# Altium schematic sheet obc_spi_to_i2c.SchDoc: SPI to I2C Bridge
size A4; DrawnBy: Mohamed Hirole; Organization: UTAT SS; DocumentNumber: 4; Revision: 1.0; SheetNumber: 4; SheetTotal: 8
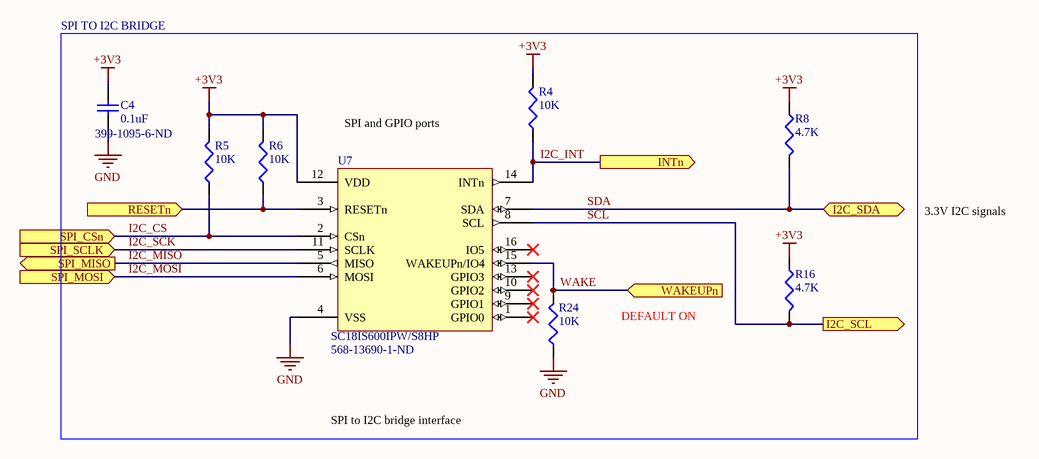
[diagram p0: obc_spi_to_i2c.SchDoc]

## Parts
C4  0.1uF  Supplier Part Number 1: 399-1095-6-ND  [1608[0603]]
R4  10K  [J1-0603]
R5  10K  [J1-0603]
R6  10K  [J1-0603]
R8  4.7K  [J1-0603]
R16  4.7K  [J1-0603]
R24  10K  [J1-0603]
U7  SC18IS600IPW/S8HP  Supplier Part Number 1: 568-13690-1-ND  [TSOP65P640X110-16N]

## Ports
I2C_SCL (out), I2C_SDA (bidir), INTn (out), RESETn (in), SPI_CSn (in), SPI_MISO (out), SPI_MOSI (in), SPI_SCLK (in), WAKEUPn (in)

## Nets
+3V3: C4.2 R4.2 R5.2 R6.2 R8.1 R16.1 U7.12(VDD)
GND: C4.1 R24.1 U7.4(VSS)
I2C_CS: R5.1 U7.2(CSn) ; port SPI_CSn
I2C_INT: R4.1 U7.14(INTn) ; port INTn
I2C_MISO: U7.5(MISO) ; port SPI_MISO
I2C_MOSI: U7.6(MOSI) ; port SPI_MOSI
I2C_SCK: U7.11(SCLK) ; port SPI_SCLK
RESETn: R6.1 U7.3(RESETn) ; port RESETn
SCL: R16.2 U7.8(SCL) ; port I2C_SCL
SDA: R8.2 U7.7(SDA) ; port I2C_SDA
WAKE: R24.2 U7.15(WAKEUPn/IO4) ; port WAKEUPn

Not connected (* = marked no-connect by the designer): U7 1(GPIO0)* 9(GPIO1)* 10(GPIO2)* 13(GPIO3)* 16(IO5)*

## Notes on the sheet
- SPI TO I2C BRIDGE
- SPI and GPIO ports
- 3.3V I2C signals
- DEFAULT ON
- SPI to I2C bridge interface

## Library data of the parts
C4 = Cap: Capacitor; Published: 8-Jun-2000; LatestRevisionDate: 17-Jul-2002; LatestRevisionNote: Re-released for DXP Platform.; PackageReference: RAD-0.3; Publisher: Altium Limited; PackageDescription: Radial Cap, Thru-Hole; 2 Leads; 0.3 in Pin Spacing; Value: 0.1uF; Supplier 1: Digi-Key
R4-R6 R8 R16 R24 = Res3: Resistor; Published: 8-Jun-2000; LatestRevisionDate: 29-May-2009; LatestRevisionNote: IPC-7351 Footprint Added.; PackageReference: J1-0603; Publisher: Altium Limited; PackageDescription: Chip Resistor
  R4-R6 R24: Value: 10K; Supplier 1: Digi-Key; Supplier Part Number 1: P10.0KHDKR-ND
  R8 R16: Value: 4.7K
U7 = SC18IS600IPW/S8HP: SPI to I2C bridge.; Supplier 1: Digikey